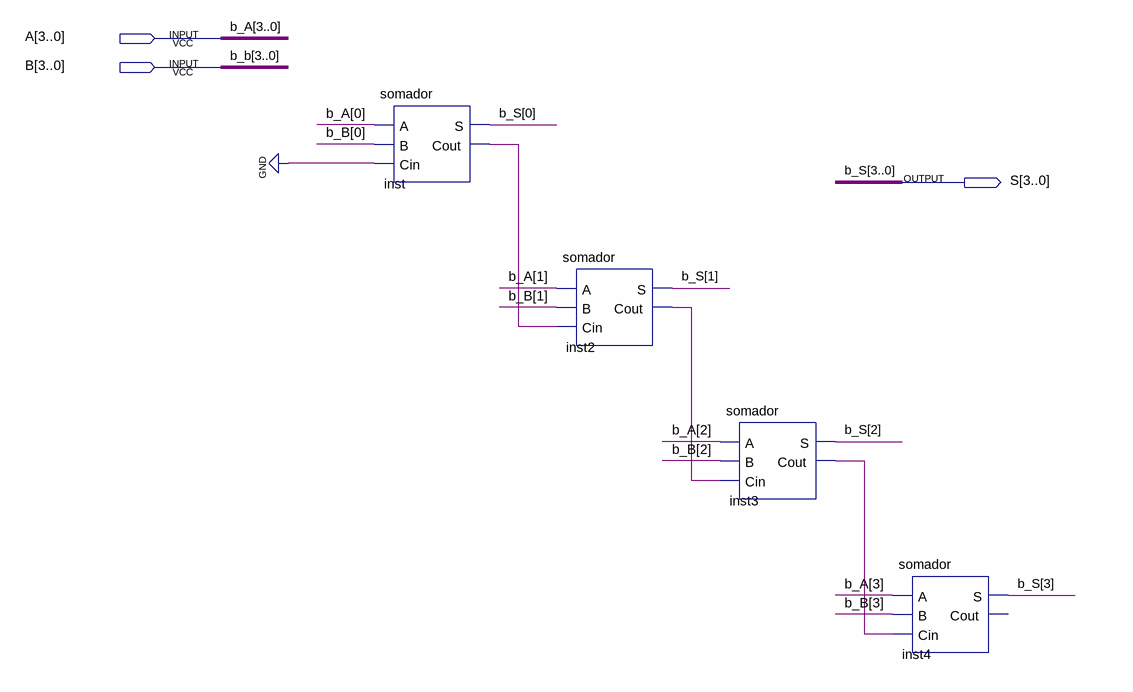
[diagram p0: schematic sheet]
// Quartus schematic soma.bdf as structural Verilog: 4 symbols, 3 pins
module soma (
  input  [3:0] A,
  input  [3:0] B,
  output [3:0] S
);

  wire inst2_cout, inst3_cout, inst_cout;

  somador inst (.A(A[0]), .B(B[0]), .Cin(1'b0), .S(S[0]), .Cout(inst_cout));
  somador inst2 (.A(A[1]), .B(B[1]), .Cin(inst_cout), .S(S[1]), .Cout(inst2_cout));
  somador inst3 (.A(A[2]), .B(B[2]), .Cin(inst2_cout), .S(S[2]), .Cout(inst3_cout));
  somador inst4 (.A(A[3]), .B(B[3]), .Cin(inst3_cout), .S(S[3]));  // open: Cout

  // Other names for the same wires on the sheet: b_A[3:0] = A; b_b[3:0] = B; b_S[3:0] = S
endmodule
